# Altium schematic sheet Realtime&EEPROM.SchDoc
size A4
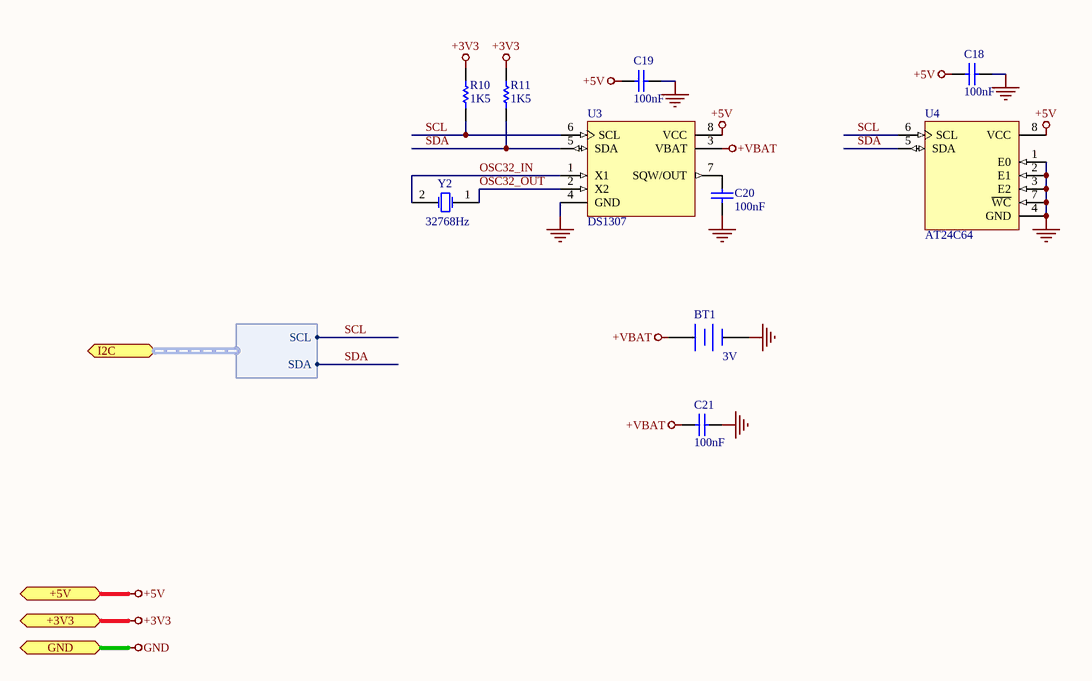
[diagram p0: Realtime&EEPROM.SchDoc]

## Parts
BT1  value 3V  [SK-BATT-CR1220]  (hidden comment: CR1220)
C18  value 100nF  [C-0805]  (hidden comment: 104)
C19  value 100nF  [C-0805]  (hidden comment: 104)
C20  value 100nF  [C-0805]  (hidden comment: 104)
C21  value 100nF  [C-0805]  (hidden comment: 104)
R10  1K5  [R-0805]
R11  1K5  [R-0805]
U3  DS1307  [SOIC-8]
U4  AT24C64  [SOIC-8]
Y2  32768Hz  [XTAL-AB38T-SMD]

## Ports
+3V3, +5V, GND, I2C (harness I2C)

## Harnesses
I2C: SCL, SDA

## Nets
+3V3: R10.2 R11.2 ; port +3V3
+5V: C18.1 C19.1 U3.8(VCC) U4.8(VCC) ; port +5V
+VBAT: BT1.1(+) C21.1 U3.3(VBAT)
GND: BT1.2(-) C18.2 C19.2 C20.2 C21.2 U3.4(GND) U4.1(E0) U4.2(E1) U4.3(E2) U4.4(GND) U4.7(~{WC}) ; port GND
OSC32_IN: U3.1(X1) Y2.2(OSC2)
OSC32_OUT: U3.2(X2) Y2.1(OSC1)
SCL: R10.1 U3.6(SCL) U4.6(SCL) ; port I2C.SCL
SDA: R11.1 U3.5(SDA) U4.5(SDA) ; port I2C.SDA
NetC20_1: C20.1 U3.7(SQW/OUT)

## Library data of the parts
BT1 = Battery: Multicell Battery; Published: 24-Mar-1999; LatestRevisionDate: 17-Jul-2002; LatestRevisionNote: Re-released for DXP Platform.; PackageReference: BAT-2; PackageDescription: Battery; 2 Leads
C18-C21 = Cap: Capacitor; Published: 8-Jun-2000; LatestRevisionDate: 17-Jul-2002; LatestRevisionNote: Re-released for DXP Platform.; PackageReference: RAD-0.3; Publisher: Altium Limited
R10 R11 = Res1: Resistor; Published: 8-Jun-2000; LatestRevisionDate: 17-Jul-2002; LatestRevisionNote: Re-released for DXP Platform.; PackageReference: AXIAL-0.3; Publisher: Altium Limited; PackageDescription: Axial Device, Thru-Hole; 2 Leads; 0.3 in Pin Spacing; Value: 1K5
U3 = DS1307: 64 X 8 Serial Real-Time Clock; Published: 13-Oct-2000; LatestRevisionDate: 17-Jul-2002; LatestRevisionNote: Re-released for DXP Platform.; DatasheetVersion: 10-Aug-1999; PackageVersion: 1999; PackageReference: DIP8; Value: DS1307; PackageDescription: DIP, 8-Pin, Row Spacing 7.62 mm, Pitch 2.54 mm; ComponentLink1Description: Manufacturer Link; ComponentLink1URL: http://www.maxim-ic.com/; ComponentLink2Description: Datasheet; ComponentLink2URL: http://pdfserv.maxim-ic.com/en/ds/DS1307.pdf; ComponentLink3Description: Discontinuation Notice; ComponentLink3URL: http://www.maxim-ic.com/qa/pdfs/non-obsolescence-letter.pdf
U4 = M24C64BN1: 64 Kbit Serial I²C Bus EEPROM; Published: 24-Aug-2001; LatestRevisionDate: 06-Jun-2005; LatestRevisionNote: Stylized 3D Model Added.; DatasheetVersion: Jul-1999; PackageVersion: Jun-1998; PackageReference: PSDIP8A; Value: AT24C64; PackageDescription: DIP; 8 Leads; Row Spacing 7.62 mm; Pitch 2.54 mm; ComponentLink1Description: Manufacturer Link; ComponentLink1URL: http://www.st.com/; ComponentLink2Description: Datasheet; ComponentLink2URL: http://www.st.com/stonline/products/literature/ds/4578/m24c32-w.pdf
Y2 = XTAL: Crystal Oscillator; Published: 8-Jun-2000; LatestRevisionDate: 17-Jul-2002; LatestRevisionNote: Re-released for DXP Platform.; PackageReference: R38; Value: 32768Hz; PackageDescription: Crystal, Thru-Hole; 2 Leads; Body 3.1 x 8.2 mm (Dia.xH)